# Altium schematic sheet Micro Controller.SchDoc
size 420 x 297 mm; Date: 22.03.2024; ApprovedBy: Arda B.; CheckedBy: Arda B.; DrawnBy: Arda Bozkurt; Revision: 001; SheetNumber: 4; SheetTotal: 9; Size: A3; Department: HDD; DOC_NO_ASSY_: __; Time: 22.03.2024
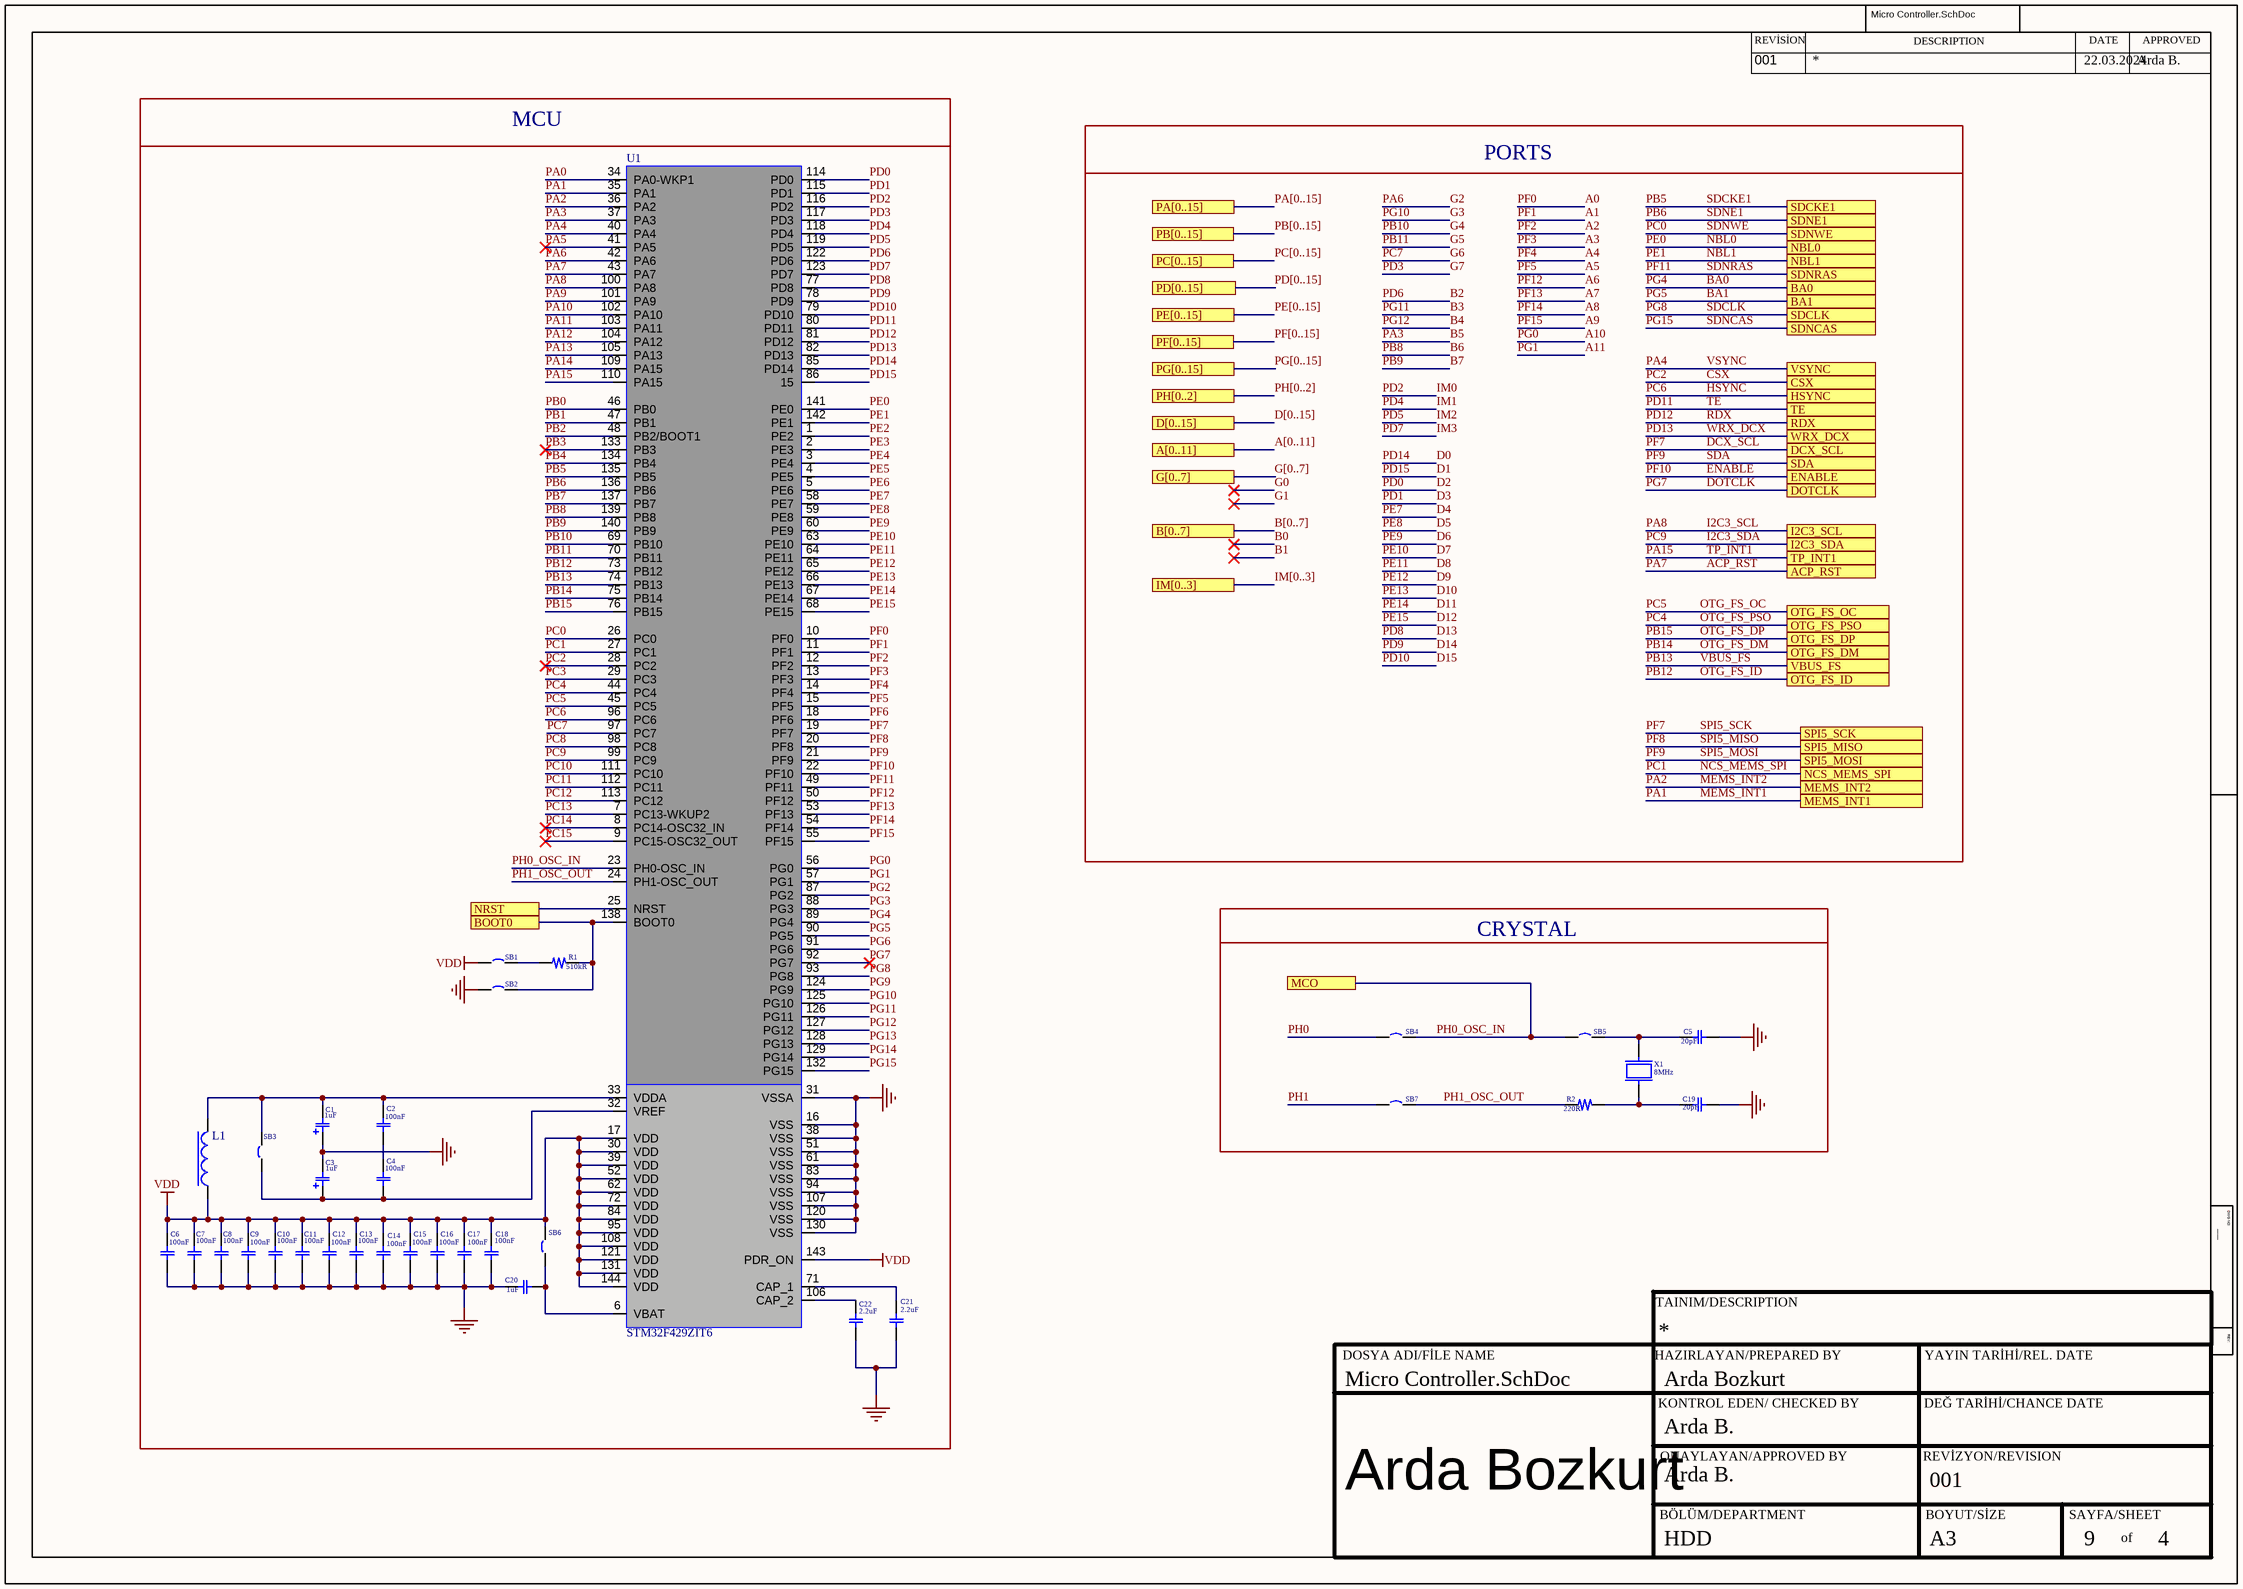
[diagram p0: Micro Controller.SchDoc]

## Parts
C1  value 1uF  [CAP-TANT]  (hidden comment: TAJA105K016RNJ)
C2  value 100nF  [CAP-0402]  (hidden comment: CC0402KRX7R7BB104)
C3  value 1uF  [CAP-TANT]  (hidden comment: TAJA105K016RNJ)
C4  value 100nF  [CAP-0402]  (hidden comment: CC0402KRX7R7BB104)
C5  value 20pF  [CAP-0402]  (hidden comment: CC0402JRNPO9BN200)
C6  value 100nF  [CAP-0402]  (hidden comment: CC0402KRX7R7BB104)
C7  value 100nF  [CAP-0402]  (hidden comment: CC0402KRX7R7BB104)
C8  value 100nF  [CAP-0402]  (hidden comment: CC0402KRX7R7BB104)
C9  value 100nF  [CAP-0402]  (hidden comment: CC0402KRX7R7BB104)
C10  value 100nF  [CAP-0402]  (hidden comment: CC0402KRX7R7BB104)
C11  value 100nF  [CAP-0402]  (hidden comment: CC0402KRX7R7BB104)
C12  value 100nF  [CAP-0402]  (hidden comment: CC0402KRX7R7BB104)
C13  value 100nF  [CAP-0402]  (hidden comment: CC0402KRX7R7BB104)
C14  value 100nF  [CAP-0402]  (hidden comment: CC0402KRX7R7BB104)
C15  value 100nF  [CAP-0402]  (hidden comment: CC0402KRX7R7BB104)
C16  value 100nF  [CAP-0402]  (hidden comment: CC0402KRX7R7BB104)
C17  value 100nF  [CAP-0402]  (hidden comment: CC0402KRX7R7BB104)
C18  value 100nF  [CAP-0402]  (hidden comment: CC0402KRX7R7BB104)
C19  value 20pF  [CAP-0402]  (hidden comment: CC0402JRNPO9BN200)
C20  value 1uF  [CAP-0603]  (hidden comment: CC0603KRX5R8BB105)
C21  value 2.2uF  [CAP-1206]  (hidden comment: CC1206KKX7R7BB225)
C22  value 2.2uF  [CAP-1206]  (hidden comment: CC1206KKX7R7BB225)
L1  FCM 1608KF-301T05  [FB-0603]  (value not drawn)
R1  value 510kR  [RES-0402]  (hidden comment: RC0402FR-07510KL)
R2  value 220R  [RES-0402]  (hidden comment: RC0402FR-07220RL)
SB1  RC0402JR-070RL  [RES-0402]  (value not drawn)
SB2  RC0402JR-070RL  [RES-0402]  (value not drawn)
SB3  RC0402JR-070RL  [RES-0402]  (value not drawn)
SB4  RC0402JR-070RL  [RES-0402]  (value not drawn)
SB5  RC0402JR-070RL  [RES-0402]  (value not drawn)
SB6  RC0402JR-070RL  [RES-0402]  (value not drawn)
SB7  RC0402JR-070RL  [RES-0402]  (value not drawn)
U1  STM32F429ZIT6  [LQFP-144]
X1  Frequency: 8MHz  [HC-49US]  (hidden comment: H1OED8K5SC-112YXC-8M)

## Ports
A[0..11] (see TOP[1B], SDRAM[4B]), ACP_RST (see TOP[1B], MEMS Motion Sensor[5B]), B[0..7] (see TOP[1B], LCD[3C]), BA0 (see TOP[2B], SDRAM[2B]), BA1 (see TOP[2B], SDRAM[2B]), BOOT0 (see TOP[1A]), CSX (see TOP[2A], LCD[2C]), D[0..15] (see TOP[1B], SDRAM[4B]), DCX_SCL (see TOP[2A], LCD[2C]), DOTCLK (see TOP[2A], LCD[2C]), ENABLE (see TOP[2A], LCD[2C]), G[0..7] (see TOP[1B], LCD[3C]), HSYNC (see TOP[2A], LCD[2C]), I2C3_SCL (see TOP[1B], LCD[4B], MEMS Motion Sensor[4B]), I2C3_SDA (see TOP[1B], LCD[4B], MEMS Motion Sensor[4B]), IM[0..3] (see TOP[1B], LCD[3C]), MCO (see TOP[1B]), MEMS_INT1 (see TOP[1B], MEMS Motion Sensor[1B]), MEMS_INT2 (see TOP[1B], MEMS Motion Sensor[1B]), NBL0 (see TOP[2B], SDRAM[3C]), NBL1 (see TOP[2B], SDRAM[3C]), NCS_MEMS_SPI (see TOP[1B], MEMS Motion Sensor[1B]), NRST (see TOP[1A], LCD[1B], MEMS Motion Sensor[3C]), OTG_FS_DM (see TOP[2B], USB[2B]), OTG_FS_DP (see TOP[2B], USB[2B]), OTG_FS_ID (see TOP[2B], USB[2B]), OTG_FS_OC (see TOP[2B], USB[4B]), OTG_FS_PSO (see TOP[2B], USB[2B]), PA[0..15] (see TOP[1A], LCD[3B], MEMS Motion Sensor[5C], ST-LINK[2C], ST-LINK[3A]), PB[0..15] (see TOP[1A], LCD[3B]), PC[0..15] (see TOP[1A], LCD[3B]), PD[0..15] (see TOP[1A]), PE[0..15] (see TOP[1A]), PF[0..15] (see TOP[1A]), PG[0..15] (see TOP[1A], LCD[3B], MEMS Motion Sensor[2C]), PH[0..2] (see TOP[1A]), RDX (see TOP[2A], LCD[2C]), SDA (see TOP[2A], LCD[2C]), SDCKE1 (see TOP[2B], SDRAM[2C]), SDCLK (see TOP[2B], SDRAM[2C]), SDNCAS (see TOP[2B], SDRAM[2C]), SDNE1 (see TOP[2B], SDRAM[2B]), SDNRAS (see TOP[2B], SDRAM[2C]), SDNWE (see TOP[2B], SDRAM[2C]), SPI5_MISO (see TOP[1B], MEMS Motion Sensor[1B]), SPI5_MOSI (see TOP[1B], MEMS Motion Sensor[1B]), SPI5_SCK (see TOP[1B], MEMS Motion Sensor[1B]), TE (see TOP[2A], LCD[2C]), TP_INT1 (see TOP[1B], LCD[4B]), VBUS_FS (see TOP[2B], USB[2B]), VSYNC (see TOP[2A], LCD[2C]), WRX_DCX (see TOP[2A], LCD[2C])

## Nets
GND: C1.1 C3.2 C5.2 C6.1 C7.1 C8.1 C9.1 C10.1 C11.1 C12.1 C13.1 C14.1 C15.1 C16.1 C17.1 C18.1 C19.2 C20.1 C21.1 C22.1 SB2.1 U1.16(VSS) U1.31(VSSA) U1.38(VSS) U1.51(VSS) U1.61(VSS) U1.83(VSS) U1.94(VSS) U1.107(VSS) U1.120(VSS) U1.130(VSS)
VDD: C6.2 C7.2 C8.2 C9.2 C10.2 C11.2 C12.2 C13.2 C14.2 C15.2 C16.2 C17.2 C18.2 L1.1 SB1.1 SB6.2 U1.17(VDD) U1.30(VDD) U1.39(VDD) U1.52(VDD) U1.62(VDD) U1.72(VDD) U1.84(VDD) U1.95(VDD) U1.108(VDD) U1.121(VDD) U1.131(VDD) U1.143(PDR_ON) U1.144(VDD)
A0: U1.10(PF0)  [also labelled PF0]
A1: U1.11(PF1)  [also labelled PF1]
A2: U1.12(PF2)  [also labelled PF2]
A3: U1.13(PF3)  [also labelled PF3]
A4: U1.14(PF4)  [also labelled PF4]
A5: U1.15(PF5)  [also labelled PF5]
A6: U1.50(PF12)  [also labelled PF12]
A7: U1.53(PF13)  [also labelled PF13]
A8: U1.54(PF14)  [also labelled PF14]
A9: U1.55(PF15)  [also labelled PF15]
A10: U1.56(PG0)  [also labelled PG0]
A11: U1.57(PG1)  [also labelled PG1]
ACP_RST: U1.43(PA7) ; port ACP_RST  [also labelled PA7]
B2: U1.122(PD6)  [also labelled PD6]
B3: U1.126(PG11)  [also labelled PG11]
B4: U1.127(PG12)  [also labelled PG12]
B5: U1.37(PA3)  [also labelled PA3]
B6: U1.139(PB8)  [also labelled PB8]
B7: U1.140(PB9)  [also labelled PB9]
BA0: U1.89(PG4) ; port BA0  [also labelled PG4]
BA1: U1.90(PG5) ; port BA1  [also labelled PG5]
BOOT0: R1.2 SB2.2 U1.138(BOOT0) ; port BOOT0
CSX: U1.28(PC2) ; port CSX  [also labelled PC2]
D0: U1.85(PD14)  [also labelled PD14]
D1: U1.86(15)  [also labelled PD15]
D2: U1.114(PD0)  [also labelled PD0]
D3: U1.115(PD1)  [also labelled PD1]
D4: U1.58(PE7)  [also labelled PE7]
D5: U1.59(PE8)  [also labelled PE8]
D6: U1.60(PE9)  [also labelled PE9]
D7: U1.63(PE10)  [also labelled PE10]
D8: U1.64(PE11)  [also labelled PE11]
D9: U1.65(PE12)  [also labelled PE12]
D10: U1.66(PE13)  [also labelled PE13]
D11: U1.67(PE14)  [also labelled PE14]
D12: U1.68(PE15)  [also labelled PE15]
D13: U1.77(PD8)  [also labelled PD8]
D14: U1.78(PD9)  [also labelled PD9]
D15: U1.79(PD10)  [also labelled PD10]
DCX_SCL: U1.19(PF7) ; port DCX_SCL, port SPI5_SCK  [also labelled PF7, SPI5_SCK]
DOTCLK: U1.92(PG7) ; port DOTCLK  [also labelled PG7]
ENABLE: U1.22(PF10) ; port ENABLE  [also labelled PF10]
G2: U1.42(PA6)  [also labelled PA6]
G3: U1.125(PG10)  [also labelled PG10]
G4: U1.69(PB10)  [also labelled PB10]
G5: U1.70(PB11)  [also labelled PB11]
G6: U1.97(PC7)  [also labelled PC7]
G7: U1.117(PD3)  [also labelled PD3]
HSYNC: U1.96(PC6) ; port HSYNC  [also labelled PC6]
I2C3_SCL: U1.100(PA8) ; port I2C3_SCL  [also labelled PA8]
I2C3_SDA: U1.99(PC9) ; port I2C3_SDA  [also labelled PC9]
IM0: U1.116(PD2)  [also labelled PD2]
IM1: U1.118(PD4)  [also labelled PD4]
IM2: U1.119(PD5)  [also labelled PD5]
IM3: U1.123(PD7)  [also labelled PD7]
MEMS_INT1: U1.35(PA1) ; port MEMS_INT1  [also labelled PA1]
MEMS_INT2: U1.36(PA2) ; port MEMS_INT2  [also labelled PA2]
NBL0: U1.141(PE0) ; port NBL0  [also labelled PE0]
NBL1: U1.142(PE1) ; port NBL1  [also labelled PE1]
NCS_MEMS_SPI: U1.27(PC1) ; port NCS_MEMS_SPI  [also labelled PC1]
NRST: U1.25(NRST) ; port NRST
OTG_FS_DM: U1.75(PB14) ; port OTG_FS_DM  [also labelled PB14]
OTG_FS_DP: U1.76(PB15) ; port OTG_FS_DP  [also labelled PB15]
OTG_FS_ID: U1.73(PB12) ; port OTG_FS_ID  [also labelled PB12]
OTG_FS_OC: U1.45(PC5) ; port OTG_FS_OC  [also labelled PC5]
OTG_FS_PSO: U1.44(PC4) ; port OTG_FS_PSO  [also labelled PC4]
PA0: U1.34(PA0-WKP1)
PA4: U1.40(PA4) ; port VSYNC  [also labelled VSYNC]
PA5: U1.41(PA5)
PA9: U1.101(PA9)
PA10: U1.102(PA10)
PA11: U1.103(PA11)
PA12: U1.104(PA12)
PA13: U1.105(PA13)
PA14: U1.109(PA15)
PA15: U1.110(PA15) ; port TP_INT1  [also labelled TP_INT1]
PB0: U1.46(PB0)
PB1: U1.47(PB1)
PB2: U1.48(PB2/BOOT1)
PB3: U1.133(PB3)
PB4: U1.134(PB4)
PB5: U1.135(PB5) ; port SDCKE1  [also labelled SDCKE1]
PB6: U1.136(PB6) ; port SDNE1  [also labelled SDNE1]
PB7: U1.137(PB7)
PB13: U1.74(PB13) ; port VBUS_FS  [also labelled VBUS_FS]
PC0: U1.26(PC0) ; port SDNWE  [also labelled SDNWE]
PC3: U1.29(PC3)
PC8: U1.98(PC8)
PC10: U1.111(PC10)
PC11: U1.112(PC11)
PC12: U1.113(PC12)
PC13: U1.7(PC13-WKUP2)
PC14: U1.8(PC14-OSC32_IN)
PC15: U1.9(PC15-OSC32_OUT)
PD11: U1.80(PD11) ; port TE  [also labelled TE]
PD12: U1.81(PD12) ; port RDX  [also labelled RDX]
PD13: U1.82(PD13) ; port WRX_DCX  [also labelled WRX_DCX]
PE2: U1.1(PE2)
PE3: U1.2(PE3)
PE4: U1.3(PE4)
PE5: U1.4(PE5)
PE6: U1.5(PE6)
PF6: U1.18(PF6)
PF8: U1.20(PF8) ; port SPI5_MISO  [also labelled SPI5_MISO]
PF9: U1.21(PF9) ; port SDA, port SPI5_MOSI  [also labelled SDA, SPI5_MOSI]
PF11: U1.49(PF11) ; port SDNRAS  [also labelled SDNRAS]
PG2: U1.87(PG2)
PG3: U1.88(PG3)
PG6: U1.91(PG6)
PG8: U1.93(PG8) ; port SDCLK  [also labelled SDCLK]
PG9: U1.124(PG9)
PG13: U1.128(PG13)
PG14: U1.129(PG14)
PG15: U1.132(PG15) ; port SDNCAS  [also labelled SDNCAS]
PH0: SB4.1
PH0_OSC_IN: SB4.2 SB5.1 U1.23(PH0-OSC_IN) ; port MCO
PH1: SB7.1
PH1_OSC_OUT: R2.1 SB7.2 U1.24(PH1-OSC_OUT)
NetC1_2: C1.2 C2.2 L1.2 SB3.2 U1.33(VDDA)
NetC2_1: C2.1 C4.2
NetC3_1: C3.1 C4.1 SB3.1 U1.32(VREF)
NetC5_1: C5.1 SB5.2 X1.2
NetC19_1: C19.1 R2.2 X1.1
NetC20_2: C20.2 SB6.1 U1.6(VBAT)
NetC21_2: C21.2 U1.71(CAP_1)
NetC22_2: C22.2 U1.106(CAP_2)
NetR1_1: R1.1 SB1.2

## Buses and harness runs
bus A[0..11] = port A[0..11]
bus B[0..7] = port B[0..7]
bus D[0..15] = port D[0..15]
bus G[0..7] = port G[0..7]
bus IM[0..3] = port IM[0..3]
bus PA[0..15] = port PA[0..15]
bus PB[0..15] = port PB[0..15]
bus PC[0..15] = port PC[0..15]
bus PD[0..15] = port PD[0..15]
bus PE[0..15] = port PE[0..15]
bus PF[0..15] = port PF[0..15]
bus PG[0..15] = port PG[0..15]
bus PH[0..2] = port PH[0..2]

## Notes on the sheet
- MCU
- PORTS
- CRYSTAL
- REVİSİON
- DESCRIPTION
- DATE
- APPROVED
- DWG NO:
- TAINIM/DESCRIPTION
- REV:
- DOSYA ADI/FİLE NAME
- HAZIRLAYAN/PREPARED BY
- KONTROL EDEN/ CHECKED BY
- YAYIN TARİHİ/REL. DATE
- DEĞ TARİHİ/CHANCE DATE
- ONAYLAYAN/APPROVED BY
- REVİZYON/REVISION
- Arda Bozkurt
- BÖLÜM/DEPARTMENT
- BOYUT/SİZE
- SAYFA/SHEET
- of

## Library data of the parts
C1 C3 = C-TANT 1UF 10% 16V 1206: Cap Tant Solid 1uF 16V A CASE 10%( 3.2 X 1.6 X 1.6mm) Inward L SMD 3216-18 11 Ohm 125C T/R; Manufacturer: Kyocera AVX; Dielectric Material: Tantalum; Tolerance: 20%; ESR (Equivalent Series Resistance): 11R; Leakage Current: 500nA; Dissipation Factor: 4%; Supplier: Avnet; Supplier Part Number: TAJA105K016RNJ; Manufacturer Part Number: TAJA105K016RNJ; RoHS: Yes; Category: Tantalum Capacitors; Stock: 104000; Pricing: 2000=0,15379 (USD); Mounting Technology: Surface Mount,PCB; Case/Package: 1206; Pins: 2; Case Code (Metric): 3216; Case Code (Imperial): 1206; Weight: 0.000571oz; Min Operating Temperature: -55°C; Max Operating Temperature: 125°C; Voltage Rating (DC): 16V; Voltage Rating: 16V; Packaging: Tape and Reel; Features: General Purpose; Series: TAJ; Termination: SMD/SMT; Voltage: 16V; Length: 3.2mm; Width: 1.6mm; Height: 1.6mm; Depth: 1.6mm; Lead Pitch: 1.1mm; Reach SVHC Compliant: No; RoHS Compliant: Yes; ComponentLink1URL: https://datasheet.ciiva.com/18710/taj-eng-18710647.pdf?src-supplier=Distrelec; ComponentLink1Description: https://datasheet.ciiva.com/18710/taj-eng-18710647.pdf?src-supplier=Distrelec; ComponentLink2URL: https://datasheet.ciiva.com/7832/taj-7832811.pdf?src-supplier=Element14; ComponentLink2Description: https://datasheet.ciiva.com/7832/taj-7832811.pdf?src-supplier=Element14; ComponentLink3URL: https://datasheet.ciiva.com/7832/taj-7832810.pdf?src-supplier=Element14; ComponentLink3Description: https://datasheet.ciiva.com/7832/taj-7832810.pdf?src-supplier=Element14; ComponentLink4URL: https://datasheet.ciiva.com/7832/1680476-7832431.pdf?src-supplier=Element14; ComponentLink4Description: https://datasheet.ciiva.com/7832/1680476-7832431.pdf?src-supplier=Element14; ComponentLink5URL: https://datasheet.ciiva.com/263/taj-263410.pdf?src-supplier=Digikey; ComponentLink5Description: https://datasheet.ciiva.com/263/taj-263410.pdf?src-supplier=Digikey; ComponentLink6URL: https://datasheet.ciiva.com/263/taj-263409.pdf?src-supplier=Digikey; ComponentLink6Description: https://datasheet.ciiva.com/263/taj-263409.pdf?src-supplier=Digikey; ComponentLink7URL: https://datasheet.ciiva.com/263/taj-263411.pdf?src-supplier=Digikey; ComponentLink7Description: https://datasheet.ciiva.com/263/taj-263411.pdf?src-supplier=Digikey; ComponentLink8URL: https://datasheet.ciiva.com/7832/1703059-7832429.pdf?src-supplier=Element14; ComponentLink8Description: https://datasheet.ciiva.com/7832/1703059-7832429.pdf?src-supplier=Element14; ComponentLink9URL: https://datasheet.ciiva.com/7832/1703059-7832430.pdf?src-supplier=Element14; ComponentLink9Description: https://datasheet.ciiva.com/7832/1703059-7832430.pdf?src-supplier=Element14
C2 C4 C6-C18 = CAP CER 100nF 16V X7R 0402: Multilayer Ceramic Capacitor, 0.1 uF, 25 V, ± 10%, X7R, 0402 [1005 Metric]; Manufacturer: Yageo; Material: 4241ConductorMaterial; Voltage Rating: 16V; Temperature Coefficient: 30ppm/°C; Supplier: Future Electronics; Supplier Part Number: 8517856; Manufacturer Part Number: CC0402KRX7R7BB104; RoHS: Yes; Category: Ceramic Capacitors; Stock: 30330000; Pricing: 10000=0,0028, 40000=0,0027, 150000=0,0025, 300000=0,0025, 750000=0,0023 (USD); Mounting Technology: Surface Mount; Case/Package: 0402; Pins: 2; Case Code (Metric): 1005; Case Code (Imperial): 0402; Min Operating Temperature: -55°C; Max Operating Temperature: 125°C; Tolerance: 10%; Dielectric: X7R; Voltage Rating (DC): 16V; Packaging: Tape and Reel; Package Quantity: 1; Termination: SMD/SMT; Voltage: 16V; Series: CC; Voltage Rating (AC): 16V; Length: 1mm; Width: 0.02inch; Height: 0.5mm; Thickness: 0.022inch; Depth: 0.5mm; Radiation Hardening: No; RoHS Compliant: Yes; Reach SVHC Compliant: No; Halogen Free: 5694HalogenFree; Lead Free: 5697LeadFree; ComponentLink1URL: https://datasheet.ciiva.com/11788/0900766b80ce67ed-11788364.pdf?src-supplier=Rs; ComponentLink1Description: https://datasheet.ciiva.com/11788/0900766b80ce67ed-11788364.pdf?src-supplier=Rs; ComponentLink2URL: https://datasheet.ciiva.com/7978/1489800-7978111.pdf?src-supplier=Element14; ComponentLink2Description: https://datasheet.ciiva.com/7978/1489800-7978111.pdf?src-supplier=Element14; ComponentLink3URL: https://datasheet.ciiva.com/161/mlccorderingcode-161545.pdf?src-supplier=Digikey; ComponentLink3Description: https://datasheet.ciiva.com/161/mlccorderingcode-161545.pdf?src-supplier=Digikey; ComponentLink4URL: https://datasheet.ciiva.com/161/mlccorderingcode-161544.pdf?src-supplier=Digikey; ComponentLink4Description: https://datasheet.ciiva.com/161/mlccorderingcode-161544.pdf?src-supplier=Digikey; ComponentLink5URL: https://datasheet.ciiva.com/161/mlccorderingcode-161546.pdf?src-supplier=Digikey; ComponentLink5Description: https://datasheet.ciiva.com/161/mlccorderingcode-161546.pdf?src-supplier=Digikey; ComponentLink6URL: https://datasheet.ciiva.com/8033/1734573-8033661.pdf?src-supplier=Element14; ComponentLink6Description: https://datasheet.ciiva.com/8033/1734573-8033661.pdf?src-supplier=Element14; ComponentLink7URL: https://datasheet.ciiva.com/11587/upy-gphc-x7r-6-3v-to-50v-8-11587305.pdf?src-supplier=Avnet; ComponentLink7Description: https://datasheet.ciiva.com/11587/upy-gphc-x7r-6-3v-to-50v-8-11587305.pdf?src-supplier=Avnet; ComponentLink8URL: https://datasheet.ciiva.com/28450/1489800-28450335.pdf?src-supplier=Element14; ComponentLink8Description: https://datasheet.ciiva.com/28450/1489800-28450335.pdf?src-supplier=Element14; ComponentLink9URL: https://datasheet.ciiva.com/13395/upy-gphc-x7r-6-3v-to-50v-8-13395676.pdf?src-supplier=Mouser; ComponentLink9Description: https://datasheet.ciiva.com/13395/upy-gphc-x7r-6-3v-to-50v-8-13395676.pdf?src-supplier=Mouser; ComponentLink10URL: https://datasheet.ciiva.com/8033/1734573-8033663.pdf?src-supplier=Element14; ComponentLink10Description: https://datasheet.ciiva.com/8033/1734573-8033663.pdf?src-supplier=Element14
C5 C19 = CAP CER 20PF 50V C0G/NPO 0402: Manufacturer: Yageo; Temperature Coefficient: 30ppm/°C; Supplier: Future Electronics; Supplier Part Number: 9739384; Manufacturer Part Number: CC0402JRNPO9BN200; RoHS: Yes; Category: Ceramic Capacitors; Stock: 60000; Pricing: 10000=0,0025, 40000=0,0023, 150000=0,0022, 300000=0,0022, 750000=0,002 (USD); Halogen Free: 5694HalogenFree; ComponentLink1URL: https://datasheet.ciiva.com/176/mlccorderingcode-176360.pdf?src-supplier=Digikey; ComponentLink1Description: https://datasheet.ciiva.com/176/mlccorderingcode-176360.pdf?src-supplier=Digikey; ComponentLink2URL: https://datasheet.ciiva.com/176/mlccorderingcode-176361.pdf?src-supplier=Digikey; ComponentLink2Description: https://datasheet.ciiva.com/176/mlccorderingcode-176361.pdf?src-supplier=Digikey; ComponentLink3URL: https://datasheet.ciiva.com/176/mlccorderingcode-176362.pdf?src-supplier=Digikey; ComponentLink3Description: https://datasheet.ciiva.com/176/mlccorderingcode-176362.pdf?src-supplier=Digikey; ComponentLink4URL: https://datasheet.ciiva.com/7656/1132289-7656614.pdf?src-supplier=Element14; ComponentLink4Description: https://datasheet.ciiva.com/7656/1132289-7656614.pdf?src-supplier=Element14; ComponentLink5URL: https://datasheet.ciiva.com/5427/upy-gp-np0-16v-to-50v-8-3714-5427769.pdf?src-supplier=Mouser; ComponentLink5Description: https://datasheet.ciiva.com/5427/upy-gp-np0-16v-to-50v-8-3714-5427769.pdf?src-supplier=Mouser
C20 = CAP CER 1UF 25V X5R 0603: Multilayer Ceramic Capacitor, 1 uF, 25 V, ± 10%, X5R, 0603 [1608 Metric]; Manufacturer: Yageo; Material: 4241ConductorMaterial; Voltage Rating: 25V; Supplier: Future Electronics; Supplier Part Number: 5636071; Manufacturer Part Number: CC0603KRX5R8BB105; RoHS: Yes; Category: Ceramic Capacitors; Stock: 3696000; Pricing: 4000=0,0113, 16000=0,0107, 40000=0,0104, 100000=0,0101, 160000=0,0095 (USD); Mounting Technology: Surface Mount; Case/Package: 0603; Pins: 2; Case Code (Metric): 1608; Case Code (Imperial): 0603; Min Operating Temperature: -55°C; Max Operating Temperature: 85°C; Tolerance: 10%; Dielectric: X5R; Packaging: Tape and Reel; Termination: SMD/SMT; Series: CC; Construction: Flat; Voltage Rating (DC): 25V; Length: 1.6mm; Height: 0.8mm; Depth: 0.8mm; Radiation Hardening: No; Reach SVHC Compliant: No; RoHS Compliant: Yes; Halogen Free: 5694HalogenFree; Lead Free: 5697LeadFree; ComponentLink1URL: https://datasheet.ciiva.com/7978/1525783-7978171.pdf?src-supplier=Element14; ComponentLink1Description: https://datasheet.ciiva.com/7978/1525783-7978171.pdf?src-supplier=Element14; ComponentLink2URL: https://datasheet.ciiva.com/176/mlccorderingcode-176786.pdf?src-supplier=Digikey; ComponentLink2Description: https://datasheet.ciiva.com/176/mlccorderingcode-176786.pdf?src-supplier=Digikey; ComponentLink3URL: https://datasheet.ciiva.com/176/mlccorderingcode-176785.pdf?src-supplier=Digikey; ComponentLink3Description: https://datasheet.ciiva.com/176/mlccorderingcode-176785.pdf?src-supplier=Digikey; ComponentLink4URL: https://datasheet.ciiva.com/176/mlccorderingcode-176787.pdf?src-supplier=Digikey; ComponentLink4Description: https://datasheet.ciiva.com/176/mlccorderingcode-176787.pdf?src-supplier=Digikey; ComponentLink5URL: https://datasheet.ciiva.com/11586/upy-gphc-x5r-4v-to-50v-12-11586318.pdf?src-supplier=Avnet; ComponentLink5Description: https://datasheet.ciiva.com/11586/upy-gphc-x5r-4v-to-50v-12-11586318.pdf?src-supplier=Avnet
C21 C22 = CAP CER 2.2UF 16V X7R 1206: Surface Mount Ceramic Multilayer Capacitor 2.2uF 10% X7R 16V 1206 Blister T/R; Manufacturer: Yageo; Material: 4241ConductorMaterial; Supplier: Future Electronics; Supplier Part Number: 6606222; Manufacturer Part Number: CC1206KKX7R7BB225; RoHS: Yes; Category: Ceramic Capacitors; Stock: 141000; Pricing: 3000=0,0378, 9000=0,0363, 15000=0,0357, 30000=0,0348, 60000=0,0335 (USD); ComponentLink1URL: https://datasheet.ciiva.com/11788/0900766b80d84f1d-11788402.pdf?src-supplier=Rs; ComponentLink1Description: https://datasheet.ciiva.com/11788/0900766b80d84f1d-11788402.pdf?src-supplier=Rs; ComponentLink2URL: https://datasheet.ciiva.com/11466/upy-gphc-x7r-6-3v-to-50v-8-11466572.pdf?src-supplier=Avnet; ComponentLink2Description: https://datasheet.ciiva.com/11466/upy-gphc-x7r-6-3v-to-50v-8-11466572.pdf?src-supplier=Avnet; ComponentLink3URL: https://datasheet.ciiva.com/5425/upy-gphc-x7r-6-3v-to-50v-8-12304-5425499.pdf?src-supplier=Mouser; ComponentLink3Description: https://datasheet.ciiva.com/5425/upy-gphc-x7r-6-3v-to-50v-8-12304-5425499.pdf?src-supplier=Mouser
L1 = FB 300 OHMS @ 100 MHZ 1 POWER, SIGN: 500mA 1 350mΩ 300Ω@100MHz ±25% 0603 Ferrite Beads ROHS; Manufacturer: Tai Tech; Supplier: Digikey; Supplier Part Number: 4816-FCM1608KF-301T05CT-ND; Manufacturer Part Number: FCM1608KF-301T05; RoHS: No; Category: Ferrite Beads and Chips; Stock: 6740; Pricing: 1=0,1, 10=0,025, 25=0,0224, 50=0,0202, 100=0,0182, 250=0,01332, 500=0,0097, 1000=0,00949 (USD)
R1 = RES 510K OHM 1% 1/16W 0402: SMD Chip Resistor, 510 kOhm, ± 1%, 63 mW, 0402 [1005 Metric], Thick Film, General Purpose; Manufacturer: Yageo; Power Rating: 63mW; Voltage Rating: 50V; Temperature Coefficient: 100ppm/°C; Supplier: Future Electronics; Supplier Part Number: 2225407; Manufacturer Part Number: RC0402FR-07510KL; RoHS: Yes; Category: Chip SMD Resistors; Stock: 3670000; Pricing: 10000=0,0019, 100000=0,0011, 200000=0,0018, 300000=0,001, 750000=0,0017, 2000000=0,0017, 7500000=0,0015 (USD); Case/Package: 0402; Case Code (Imperial): 0402; Case Code (Metric): 1005; Min Operating Temperature: -55°C; Max Operating Temperature: 155°C; Tolerance: 1%; Packaging: Tape and Reel; Package Quantity: 1; Termination: SMD/SMT; Resistor Type: Thick Film; Number of Terminations: 2; Max Power Dissipation: 63mW; Features: Moisture Resistant; Series: RC; Construction: Rectangular; Resistance Tolerance: 1%; Technology: THICK FILM; Voltage Rating (DC): 50V; Length: 1mm; Width: 0.02inch; Height: 0.016inch; Depth: 0.5mm; Military Standard: Not; RoHS Compliant: Yes; Reach SVHC Compliant: Unknown; Lead Free: 5697LeadFree; ComponentLink1URL: https://datasheet.ciiva.com/11808/0900766b80c66297-11808810.pdf?src-supplier=Rs; ComponentLink1Description: https://datasheet.ciiva.com/11808/0900766b80c66297-11808810.pdf?src-supplier=Rs; ComponentLink2URL: https://datasheet.ciiva.com/2453/pyu-r-int-thick-7-2453464.pdf?src-supplier=Digikey; ComponentLink2Description: https://datasheet.ciiva.com/2453/pyu-r-int-thick-7-2453464.pdf?src-supplier=Digikey; ComponentLink3URL: https://datasheet.ciiva.com/2453/pyu-r-int-thick-7-2453463.pdf?src-supplier=Digikey; ComponentLink3Description: https://datasheet.ciiva.com/2453/pyu-r-int-thick-7-2453463.pdf?src-supplier=Digikey; ComponentLink4URL: https://datasheet.ciiva.com/17419/pyu-rc0402-51-rohs-l-6-r-17419596.pdf?src-supplier=Future+Electronics; ComponentLink4Description: https://datasheet.ciiva.com/17419/pyu-rc0402-51-rohs-l-6-r-17419596.pdf?src-supplier=Future+Electronics; ComponentLink5URL: https://datasheet.ciiva.com/2453/pyu-r-int-thick-7-2453465.pdf?src-supplier=Digikey; ComponentLink5Description: https://datasheet.ciiva.com/2453/pyu-r-int-thick-7-2453465.pdf?src-supplier=Digikey
R2 = RES 220 OHM 1% 1/16W 0402: SMD Chip Resistor, 220 Ohm, ± 1%, 63 mW, 0402 [1005 Metric], Thick Film, General Purpose; Manufacturer: Yageo; Power Rating: 62.5mW; Voltage Rating: 50V; Temperature Coefficient: 100ppm/°C; Max Power Dissipation: 63mW; Supplier: Future Electronics; Supplier Part Number: 4696860; Manufacturer Part Number: RC0402FR-07220RL; RoHS: Yes; Category: Chip SMD Resistors; Stock: 3710000; Pricing: 10000=0,0012, 100000=0,0011, 200000=0,0011, 300000=0,001, 750000=0,0011, 2000000=0,0009, 2500000=0,001, 10000000=0,0009 (USD); Case/Package: 0402; Pins: 2; Case Code (Imperial): 0402; Case Code (Metric): 1005; Min Operating Temperature: -55°C; Max Operating Temperature: 155°C; Tolerance: 1%; Packaging: Tape and Reel; Voltage Rating (DC): 50V; Package Quantity: 1; Termination: SMD/SMT; Resistor Type: Thick Film; Number of Terminations: 2; Features: Moisture Resistant; Series: RC; Resistance Tolerance: 1%; Construction: Rectangular; Technology: THICK FILM; Voltage Rating (AC): 50V; Length: 0.039inch; Width: 0.02inch; Height: 0.016inch; Depth: 0.5mm; Reach SVHC Compliant: No; Military Standard: Not; RoHS Compliant: Yes; Lead Free: 5697LeadFree; ComponentLink1URL: https://datasheet.ciiva.com/2453/pyu-r-int-thick-7-2453461.pdf?src-supplier=Digikey; ComponentLink1Description: https://datasheet.ciiva.com/2453/pyu-r-int-thick-7-2453461.pdf?src-supplier=Digikey
SB1-SB7 = RES 0 OHM JUMPER 1/10W 0603: Zero Ohm Resistor, Jumper, 0402 [1005 Metric], Thick Film, 62.5 mW, 1 A, Surface Mount; Manufacturer: Yageo; Manufacturer Part Number: RC0603JR-070RL; Tolerance: 1%; Power Rating: 100mW; Voltage Rating (DC): 50V; Temperature Coefficient: 200ppm/°C; Resistance Tolerance: 5%; Value: 0mR; Supplier: Future Electronics; Supplier Part Number: 3992146; RoHS: Yes; Category: Chip SMD Resistors; Stock: 16200000; Pricing: 5000=0,0016, 50000=0,0014, 100000=0,0015, 150000=0,0014, 375000=0,0014, 1000000=0,0012, 1250000=0,0013, 5000000=0,0012 (USD); Case/Package: 0603; Pins: 2; Contact Plating: Tin,Matte; Case Code (Imperial): 0402; Case Code (Metric): 1608; Min Operating Temperature: -55°C; Max Operating Temperature: 155°C; Resistor Type: Thick Film; Packaging: Tape and Reel; Termination: SMD/SMT; Series: RC; Technology: THICK FILM; Package Quantity: 5000; Voltage Rating: 50V; Features: Moisture Resistant; Max Power Dissipation: 100mW; Number of Terminations: 2; Construction: Rectangular; Length: 1.6mm; Width: 0.8mm; Height: 0.45mm; Depth: 0.8mm; RoHS Compliant: Yes; Reach SVHC Compliant: Unknown; Lead Free: 5697LeadFree; Military Standard: Not
U1 = IC MCU 32BIT 2MB FLASH 144LQFP: RISC Microcontroller, 32-Bit, FLASH, CORTEX-M4F CPU, 180MHz, CMOS, PQFP144; Manufacturer: STMicroelectronics; Density: 2MB; Nominal Supply Current: 1.7uA; Number of A/D Converters: 3NUMBER; Number of Channels: 24NUMBER; Number of D/A Converters: 2NUMBER; Supplier: Mouser; Supplier Part Number: 511-STM32F429ZIT6; Manufacturer Part Number: STM32F429ZIT6; RoHS: Yes; Category: Microcontrollers; Stock: 1510; Pricing: 1=18,06, 10=16,6, 50=15,92, 100=14,02, 1000=12,47, 10000=12,47 (USD); ComponentLink1URL: https://datasheet.ciiva.com/28647/1818195-28647943.pdf?src-supplier=Element14; ComponentLink1Description: https://datasheet.ciiva.com/28647/1818195-28647943.pdf?src-supplier=Element14; ComponentLink2URL: https://datasheet.ciiva.com/29987/dm00071990-29987273.pdf?src-supplier=Avnet; ComponentLink2Description: https://datasheet.ciiva.com/29987/dm00071990-29987273.pdf?src-supplier=Avnet; ComponentLink3URL: https://datasheet.ciiva.com/29722/dm00053488-29722151.pdf?src-supplier=Digikey; ComponentLink3Description: https://datasheet.ciiva.com/29722/dm00053488-29722151.pdf?src-supplier=Digikey
X1 = Crystal 8MHZ 20PF 20PPM H1OED8K5: HC-49US 8MHZ 20PF 20PPM H1OED8K5; Manufacturer: YXC; Equivalent Series Resistance: 60OHMs; ComponentLink1Description: Datasheet; ComponentLink1URL: https://mm.digikey.com/Volume0/opasdata/d220001/medias/docus/4129/HC-49US_Dip.pdf; Series: HC-49US; Frequency Stability: 20ppm; Load Capacitance: 20pF; Mounting Type: Through Hole; Height-Size-Dimension: 0.145" (3.68mm)-0.453" L x 0.177" W (11.50mm x 4.50mm)